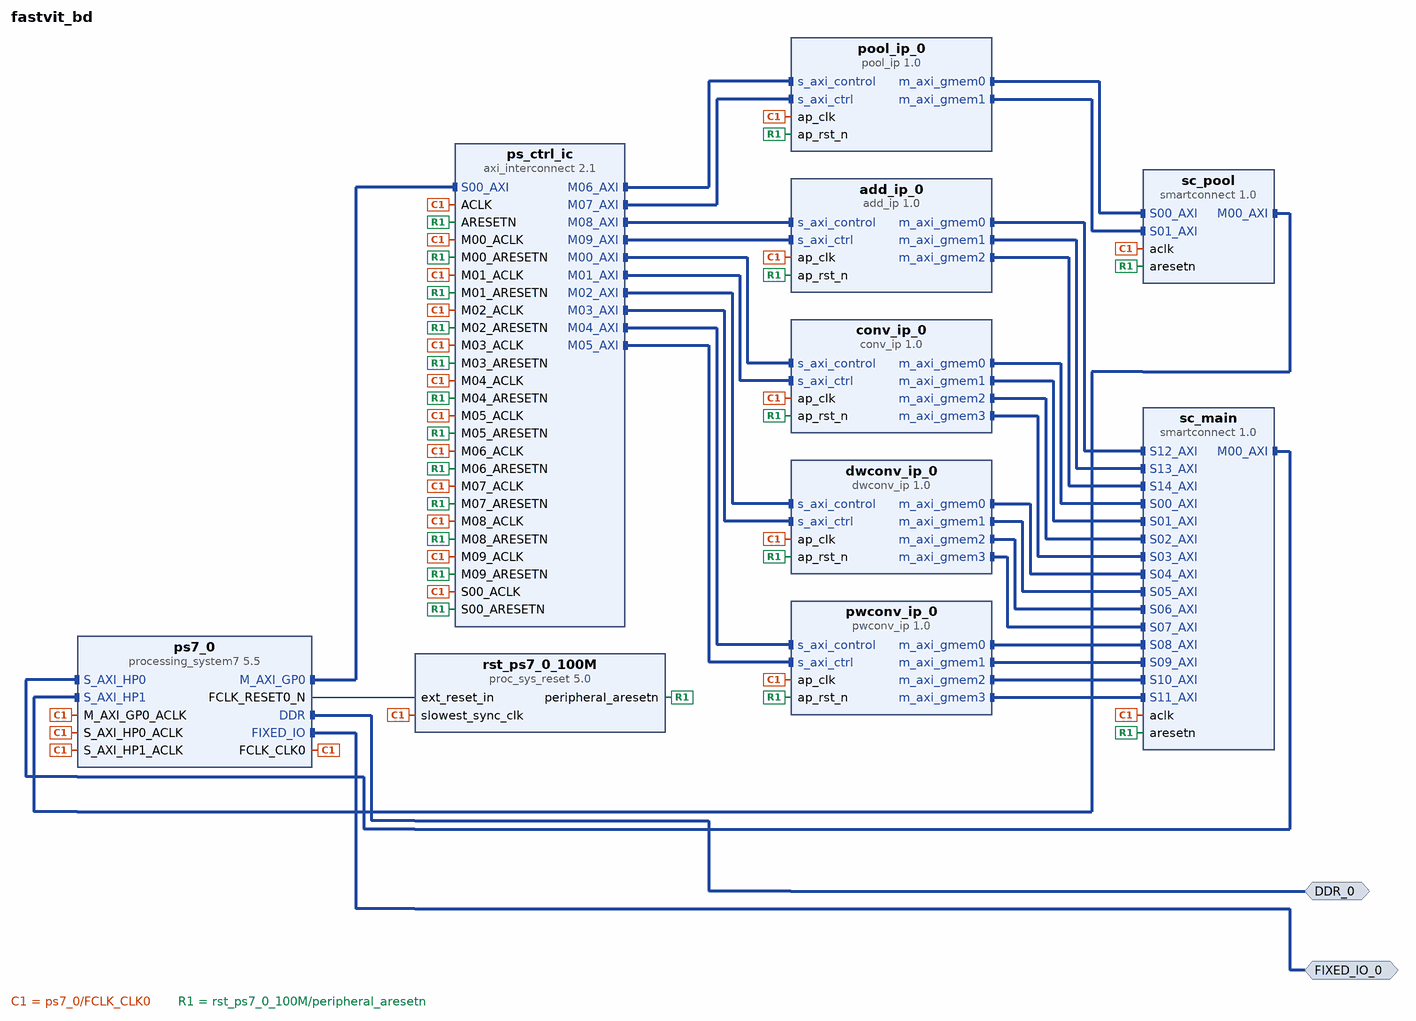
[diagram p0: block diagram of the top level]
# Vivado block design fastvit_bd, xc7z020clg400-1, Vivado 2024.2
create_bd_design fastvit_bd

create_bd_intf_port -mode Master -vlnv xilinx.com:interface:ddrx_rtl:1.0 DDR_0
create_bd_intf_port -mode Master -vlnv xilinx.com:display_processing_system7:fixedio_rtl:1.0 FIXED_IO_0

create_bd_cell -type ip -vlnv xilinx.com:ip:processing_system7:5.5 ps7_0
set_property -dict [list \
  CONFIG.PCW_FPGA0_PERIPHERAL_FREQMHZ 100 \
  CONFIG.PCW_USE_S_AXI_HP0 1 \
  CONFIG.PCW_USE_S_AXI_HP1 1 \
] [get_bd_cells ps7_0]
# 33 more settings of ps7_0 are not shown: defaults, MIO pin electricals, DDR timing, and values the tool derives
create_bd_cell -type ip -vlnv user.org:hls:conv_ip:1.0 conv_ip_0
create_bd_cell -type ip -vlnv user.org:hls:dwconv_ip:1.0 dwconv_ip_0
create_bd_cell -type ip -vlnv user.org:hls:pwconv_ip:1.0 pwconv_ip_0
create_bd_cell -type ip -vlnv user.org:hls:pool_ip:1.0 pool_ip_0
create_bd_cell -type ip -vlnv user.org:hls:add_ip:1.0 add_ip_0
create_bd_cell -type ip -vlnv xilinx.com:ip:proc_sys_reset:5.0 rst_ps7_0_100M
create_bd_cell -type ip -vlnv xilinx.com:ip:axi_interconnect:2.1 ps_ctrl_ic
set_property -dict {CONFIG.NUM_MI 10 CONFIG.NUM_SI 1} [get_bd_cells ps_ctrl_ic]
create_bd_cell -type ip -vlnv xilinx.com:ip:smartconnect:1.0 sc_main
set_property -dict {CONFIG.NUM_SI 15} [get_bd_cells sc_main]
create_bd_cell -type ip -vlnv xilinx.com:ip:smartconnect:1.0 sc_pool
set_property -dict {CONFIG.NUM_SI 2} [get_bd_cells sc_pool]

# ---- connections ----

connect_bd_intf_net [get_bd_intf_pins add_ip_0/m_axi_gmem0] [get_bd_intf_pins sc_main/S12_AXI]
connect_bd_intf_net [get_bd_intf_pins add_ip_0/m_axi_gmem1] [get_bd_intf_pins sc_main/S13_AXI]
connect_bd_intf_net [get_bd_intf_pins add_ip_0/m_axi_gmem2] [get_bd_intf_pins sc_main/S14_AXI]
connect_bd_intf_net [get_bd_intf_pins conv_ip_0/m_axi_gmem0] [get_bd_intf_pins sc_main/S00_AXI]
connect_bd_intf_net [get_bd_intf_pins conv_ip_0/m_axi_gmem1] [get_bd_intf_pins sc_main/S01_AXI]
connect_bd_intf_net [get_bd_intf_pins conv_ip_0/m_axi_gmem2] [get_bd_intf_pins sc_main/S02_AXI]
connect_bd_intf_net [get_bd_intf_pins conv_ip_0/m_axi_gmem3] [get_bd_intf_pins sc_main/S03_AXI]
connect_bd_intf_net [get_bd_intf_pins dwconv_ip_0/m_axi_gmem0] [get_bd_intf_pins sc_main/S04_AXI]
connect_bd_intf_net [get_bd_intf_pins dwconv_ip_0/m_axi_gmem1] [get_bd_intf_pins sc_main/S05_AXI]
connect_bd_intf_net [get_bd_intf_pins dwconv_ip_0/m_axi_gmem2] [get_bd_intf_pins sc_main/S06_AXI]
connect_bd_intf_net [get_bd_intf_pins dwconv_ip_0/m_axi_gmem3] [get_bd_intf_pins sc_main/S07_AXI]
connect_bd_intf_net [get_bd_intf_pins pool_ip_0/m_axi_gmem0] [get_bd_intf_pins sc_pool/S00_AXI]
connect_bd_intf_net [get_bd_intf_pins pool_ip_0/m_axi_gmem1] [get_bd_intf_pins sc_pool/S01_AXI]
connect_bd_intf_net [get_bd_intf_ports DDR_0] [get_bd_intf_pins ps7_0/DDR]
connect_bd_intf_net [get_bd_intf_ports FIXED_IO_0] [get_bd_intf_pins ps7_0/FIXED_IO]
connect_bd_intf_net [get_bd_intf_pins ps7_0/M_AXI_GP0] [get_bd_intf_pins ps_ctrl_ic/S00_AXI]
connect_bd_intf_net [get_bd_intf_pins ps_ctrl_ic/M00_AXI] [get_bd_intf_pins conv_ip_0/s_axi_control]
connect_bd_intf_net [get_bd_intf_pins ps_ctrl_ic/M01_AXI] [get_bd_intf_pins conv_ip_0/s_axi_ctrl]
connect_bd_intf_net [get_bd_intf_pins ps_ctrl_ic/M02_AXI] [get_bd_intf_pins dwconv_ip_0/s_axi_control]
connect_bd_intf_net [get_bd_intf_pins ps_ctrl_ic/M03_AXI] [get_bd_intf_pins dwconv_ip_0/s_axi_ctrl]
connect_bd_intf_net [get_bd_intf_pins ps_ctrl_ic/M04_AXI] [get_bd_intf_pins pwconv_ip_0/s_axi_control]
connect_bd_intf_net [get_bd_intf_pins ps_ctrl_ic/M05_AXI] [get_bd_intf_pins pwconv_ip_0/s_axi_ctrl]
connect_bd_intf_net [get_bd_intf_pins ps_ctrl_ic/M06_AXI] [get_bd_intf_pins pool_ip_0/s_axi_control]
connect_bd_intf_net [get_bd_intf_pins ps_ctrl_ic/M07_AXI] [get_bd_intf_pins pool_ip_0/s_axi_ctrl]
connect_bd_intf_net [get_bd_intf_pins ps_ctrl_ic/M08_AXI] [get_bd_intf_pins add_ip_0/s_axi_control]
connect_bd_intf_net [get_bd_intf_pins ps_ctrl_ic/M09_AXI] [get_bd_intf_pins add_ip_0/s_axi_ctrl]
connect_bd_intf_net [get_bd_intf_pins pwconv_ip_0/m_axi_gmem0] [get_bd_intf_pins sc_main/S08_AXI]
connect_bd_intf_net [get_bd_intf_pins pwconv_ip_0/m_axi_gmem1] [get_bd_intf_pins sc_main/S09_AXI]
connect_bd_intf_net [get_bd_intf_pins pwconv_ip_0/m_axi_gmem2] [get_bd_intf_pins sc_main/S10_AXI]
connect_bd_intf_net [get_bd_intf_pins pwconv_ip_0/m_axi_gmem3] [get_bd_intf_pins sc_main/S11_AXI]
connect_bd_intf_net [get_bd_intf_pins sc_main/M00_AXI] [get_bd_intf_pins ps7_0/S_AXI_HP0]
connect_bd_intf_net [get_bd_intf_pins sc_pool/M00_AXI] [get_bd_intf_pins ps7_0/S_AXI_HP1]
connect_bd_net [get_bd_pins ps7_0/FCLK_CLK0] \
  [get_bd_pins rst_ps7_0_100M/slowest_sync_clk] [get_bd_pins conv_ip_0/ap_clk] [get_bd_pins dwconv_ip_0/ap_clk] \
  [get_bd_pins pwconv_ip_0/ap_clk] [get_bd_pins pool_ip_0/ap_clk] [get_bd_pins add_ip_0/ap_clk] \
  [get_bd_pins ps7_0/M_AXI_GP0_ACLK] [get_bd_pins ps7_0/S_AXI_HP0_ACLK] [get_bd_pins ps7_0/S_AXI_HP1_ACLK] \
  [get_bd_pins ps_ctrl_ic/ACLK] [get_bd_pins ps_ctrl_ic/S00_ACLK] [get_bd_pins ps_ctrl_ic/M00_ACLK] \
  [get_bd_pins ps_ctrl_ic/M01_ACLK] [get_bd_pins ps_ctrl_ic/M02_ACLK] [get_bd_pins ps_ctrl_ic/M03_ACLK] \
  [get_bd_pins ps_ctrl_ic/M04_ACLK] [get_bd_pins ps_ctrl_ic/M05_ACLK] [get_bd_pins ps_ctrl_ic/M06_ACLK] \
  [get_bd_pins ps_ctrl_ic/M07_ACLK] [get_bd_pins ps_ctrl_ic/M08_ACLK] [get_bd_pins ps_ctrl_ic/M09_ACLK] \
  [get_bd_pins sc_main/aclk] [get_bd_pins sc_pool/aclk]
connect_bd_net [get_bd_pins ps7_0/FCLK_RESET0_N] [get_bd_pins rst_ps7_0_100M/ext_reset_in]
connect_bd_net [get_bd_pins rst_ps7_0_100M/peripheral_aresetn] \
  [get_bd_pins conv_ip_0/ap_rst_n] [get_bd_pins dwconv_ip_0/ap_rst_n] [get_bd_pins pwconv_ip_0/ap_rst_n] \
  [get_bd_pins pool_ip_0/ap_rst_n] [get_bd_pins add_ip_0/ap_rst_n] [get_bd_pins ps_ctrl_ic/ARESETN] \
  [get_bd_pins ps_ctrl_ic/S00_ARESETN] [get_bd_pins ps_ctrl_ic/M00_ARESETN] [get_bd_pins ps_ctrl_ic/M01_ARESETN] \
  [get_bd_pins ps_ctrl_ic/M02_ARESETN] [get_bd_pins ps_ctrl_ic/M03_ARESETN] [get_bd_pins ps_ctrl_ic/M04_ARESETN] \
  [get_bd_pins ps_ctrl_ic/M05_ARESETN] [get_bd_pins ps_ctrl_ic/M06_ARESETN] [get_bd_pins ps_ctrl_ic/M07_ARESETN] \
  [get_bd_pins ps_ctrl_ic/M08_ARESETN] [get_bd_pins ps_ctrl_ic/M09_ARESETN] [get_bd_pins sc_main/aresetn] \
  [get_bd_pins sc_pool/aresetn]

# ---- address map ----
assign_bd_address -offset 0x0000000000000000 -range 512M -target_address_space [get_bd_addr_spaces add_ip_0/Data_m_axi_gmem0] [get_bd_addr_segs ps7_0/S_AXI_HP0/HP0_DDR_LOWOCM]
assign_bd_address -offset 0x0000000000000000 -range 512M -target_address_space [get_bd_addr_spaces add_ip_0/Data_m_axi_gmem1] [get_bd_addr_segs ps7_0/S_AXI_HP0/HP0_DDR_LOWOCM]
assign_bd_address -offset 0x0000000000000000 -range 512M -target_address_space [get_bd_addr_spaces add_ip_0/Data_m_axi_gmem2] [get_bd_addr_segs ps7_0/S_AXI_HP0/HP0_DDR_LOWOCM]
assign_bd_address -offset 0x0000000000000000 -range 512M -target_address_space [get_bd_addr_spaces conv_ip_0/Data_m_axi_gmem0] [get_bd_addr_segs ps7_0/S_AXI_HP0/HP0_DDR_LOWOCM]
assign_bd_address -offset 0x0000000000000000 -range 512M -target_address_space [get_bd_addr_spaces conv_ip_0/Data_m_axi_gmem1] [get_bd_addr_segs ps7_0/S_AXI_HP0/HP0_DDR_LOWOCM]
assign_bd_address -offset 0x0000000000000000 -range 512M -target_address_space [get_bd_addr_spaces conv_ip_0/Data_m_axi_gmem2] [get_bd_addr_segs ps7_0/S_AXI_HP0/HP0_DDR_LOWOCM]
assign_bd_address -offset 0x0000000000000000 -range 512M -target_address_space [get_bd_addr_spaces conv_ip_0/Data_m_axi_gmem3] [get_bd_addr_segs ps7_0/S_AXI_HP0/HP0_DDR_LOWOCM]
assign_bd_address -offset 0x0000000000000000 -range 512M -target_address_space [get_bd_addr_spaces dwconv_ip_0/Data_m_axi_gmem0] [get_bd_addr_segs ps7_0/S_AXI_HP0/HP0_DDR_LOWOCM]
assign_bd_address -offset 0x0000000000000000 -range 512M -target_address_space [get_bd_addr_spaces dwconv_ip_0/Data_m_axi_gmem1] [get_bd_addr_segs ps7_0/S_AXI_HP0/HP0_DDR_LOWOCM]
assign_bd_address -offset 0x0000000000000000 -range 512M -target_address_space [get_bd_addr_spaces dwconv_ip_0/Data_m_axi_gmem2] [get_bd_addr_segs ps7_0/S_AXI_HP0/HP0_DDR_LOWOCM]
assign_bd_address -offset 0x0000000000000000 -range 512M -target_address_space [get_bd_addr_spaces dwconv_ip_0/Data_m_axi_gmem3] [get_bd_addr_segs ps7_0/S_AXI_HP0/HP0_DDR_LOWOCM]
assign_bd_address -offset 0x0000000000000000 -range 512M -target_address_space [get_bd_addr_spaces pool_ip_0/Data_m_axi_gmem0] [get_bd_addr_segs ps7_0/S_AXI_HP1/HP1_DDR_LOWOCM]
assign_bd_address -offset 0x0000000000000000 -range 512M -target_address_space [get_bd_addr_spaces pool_ip_0/Data_m_axi_gmem1] [get_bd_addr_segs ps7_0/S_AXI_HP1/HP1_DDR_LOWOCM]
assign_bd_address -offset 0x40000000 -range 64K -target_address_space [get_bd_addr_spaces ps7_0/Data] [get_bd_addr_segs add_ip_0/s_axi_control/Reg]
assign_bd_address -offset 0x40010000 -range 64K -target_address_space [get_bd_addr_spaces ps7_0/Data] [get_bd_addr_segs add_ip_0/s_axi_ctrl/Reg]
assign_bd_address -offset 0x40020000 -range 64K -target_address_space [get_bd_addr_spaces ps7_0/Data] [get_bd_addr_segs conv_ip_0/s_axi_control/Reg]
assign_bd_address -offset 0x40030000 -range 64K -target_address_space [get_bd_addr_spaces ps7_0/Data] [get_bd_addr_segs conv_ip_0/s_axi_ctrl/Reg]
assign_bd_address -offset 0x40040000 -range 64K -target_address_space [get_bd_addr_spaces ps7_0/Data] [get_bd_addr_segs dwconv_ip_0/s_axi_control/Reg]
assign_bd_address -offset 0x40050000 -range 64K -target_address_space [get_bd_addr_spaces ps7_0/Data] [get_bd_addr_segs dwconv_ip_0/s_axi_ctrl/Reg]
assign_bd_address -offset 0x40060000 -range 64K -target_address_space [get_bd_addr_spaces ps7_0/Data] [get_bd_addr_segs pool_ip_0/s_axi_control/Reg]
assign_bd_address -offset 0x40070000 -range 64K -target_address_space [get_bd_addr_spaces ps7_0/Data] [get_bd_addr_segs pool_ip_0/s_axi_ctrl/Reg]
assign_bd_address -offset 0x40080000 -range 64K -target_address_space [get_bd_addr_spaces ps7_0/Data] [get_bd_addr_segs pwconv_ip_0/s_axi_control/Reg]
assign_bd_address -offset 0x40090000 -range 64K -target_address_space [get_bd_addr_spaces ps7_0/Data] [get_bd_addr_segs pwconv_ip_0/s_axi_ctrl/Reg]
assign_bd_address -offset 0x0000000000000000 -range 512M -target_address_space [get_bd_addr_spaces pwconv_ip_0/Data_m_axi_gmem0] [get_bd_addr_segs ps7_0/S_AXI_HP0/HP0_DDR_LOWOCM]
assign_bd_address -offset 0x0000000000000000 -range 512M -target_address_space [get_bd_addr_spaces pwconv_ip_0/Data_m_axi_gmem1] [get_bd_addr_segs ps7_0/S_AXI_HP0/HP0_DDR_LOWOCM]
assign_bd_address -offset 0x0000000000000000 -range 512M -target_address_space [get_bd_addr_spaces pwconv_ip_0/Data_m_axi_gmem2] [get_bd_addr_segs ps7_0/S_AXI_HP0/HP0_DDR_LOWOCM]
assign_bd_address -offset 0x0000000000000000 -range 512M -target_address_space [get_bd_addr_spaces pwconv_ip_0/Data_m_axi_gmem3] [get_bd_addr_segs ps7_0/S_AXI_HP0/HP0_DDR_LOWOCM]

validate_bd_design
save_bd_design
